# Altium project multimeter.prjpcb
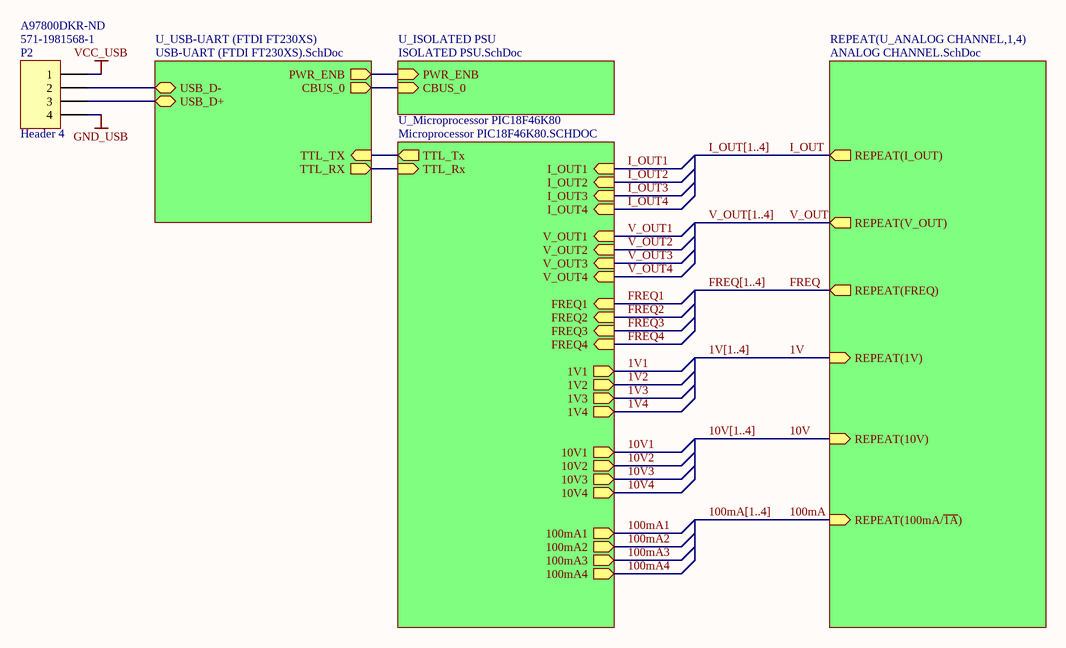
[diagram p0: Multi2Meter.SchDoc]
5 sheets, 179 parts. Net scope: hierarchical (ports join the sheet entries above them; power ports are global).
Board file: m2m.PcbDoc
Sheets:
  Multi2Meter.SchDoc
    U_ISOLATED PSU = ISOLATED PSU.SchDoc
    U_USB-UART (FTDI FT230XS) = USB-UART (FTDI FT230XS).SchDoc
    U_Microprocessor PIC18F46K80 = Microprocessor PIC18F46K80.SCHDOC
    U_ANALOG CHANNEL1 = ANALOG CHANNEL.SchDoc
    U_ANALOG CHANNEL2 = ANALOG CHANNEL.SchDoc
    U_ANALOG CHANNEL3 = ANALOG CHANNEL.SchDoc
    U_ANALOG CHANNEL4 = ANALOG CHANNEL.SchDoc

## Sheet Multi2Meter.SchDoc
size A4

### Parts
P2  Header 4  Supplier Part Number 1: 571-1981568-1  Supplier Part Number 2: A97800DKR-ND  [MICRO USB]

### Sub-sheets
REPEAT(U_ANALOG CHANNEL,1,4) = ANALOG CHANNEL.SchDoc: REPEAT(FREQ) (out), REPEAT(1V) (in), REPEAT(10V) (in), REPEAT(100mA/~{1A}) (in), REPEAT(I_OUT) (out), REPEAT(V_OUT) (out)
U_ISOLATED PSU = ISOLATED PSU.SchDoc: PWR_ENB (in), CBUS_0 (in)
U_Microprocessor PIC18F46K80 = Microprocessor PIC18F46K80.SCHDOC: TTL_Rx (in), TTL_Tx (out), I_OUT1 (in), I_OUT2 (in), I_OUT3 (in), I_OUT4 (in), V_OUT1 (in), V_OUT2 (in), V_OUT3 (in), V_OUT4 (in), FREQ1 (in), FREQ2 (in), FREQ3 (in), FREQ4 (in), 1V1 (out), 1V2 (out), 1V3 (out), 1V4 (out), 10V1 (out), 10V2 (out), 10V3 (out), 10V4 (out), 100mA1 (out), 100mA2 (out), 100mA3 (out), 100mA4 (out)
U_USB-UART (FTDI FT230XS) = USB-UART (FTDI FT230XS).SchDoc: TTL_TX (in), TTL_RX (out), PWR_ENB (out), CBUS_0 (out), USB_D- (bidir), USB_D+ (bidir)

### Nets
GND_USB: P2.4
VCC_USB: P2.1
1V: sheet REPEAT(U_ANALOG CHANNEL,1,4)/REPEAT(1V)
10V: sheet REPEAT(U_ANALOG CHANNEL,1,4)/REPEAT(10V)
100mA: sheet REPEAT(U_ANALOG CHANNEL,1,4)/REPEAT(100mA/~{1A})
CBUS_0: sheet U_ISOLATED PSU/CBUS_0, sheet U_USB-UART (FTDI FT230XS)/CBUS_0
FREQ: sheet REPEAT(U_ANALOG CHANNEL,1,4)/REPEAT(FREQ)
I_OUT: sheet REPEAT(U_ANALOG CHANNEL,1,4)/REPEAT(I_OUT)
PWR_ENB: sheet U_ISOLATED PSU/PWR_ENB, sheet U_USB-UART (FTDI FT230XS)/PWR_ENB
TTL_RX: sheet U_USB-UART (FTDI FT230XS)/TTL_RX, sheet U_Microprocessor PIC18F46K80/TTL_Rx
TTL_TX: sheet U_USB-UART (FTDI FT230XS)/TTL_TX, sheet U_Microprocessor PIC18F46K80/TTL_Tx
USB_D+: P2.3 ; sheet U_USB-UART (FTDI FT230XS)/USB_D+
USB_D-: P2.2 ; sheet U_USB-UART (FTDI FT230XS)/USB_D-
V_OUT: sheet REPEAT(U_ANALOG CHANNEL,1,4)/REPEAT(V_OUT)

### Buses and harness runs
bus 1V[1..4]
bus 10V[1..4]
bus 100mA[1..4]
bus FREQ[1..4]
bus I_OUT[1..4]
bus V_OUT[1..4]

### Library data of the parts
P2 = Header 4: Header, 4-Pin; LatestRevisionDate: 17-Jul-2002; LatestRevisionNote: Re-released for DXP Platform.; Publisher: Altium Limited; Supplier 1: Mouser; Supplier 2: Digi-Key

## Sheet ISOLATED PSU.SchDoc
size A4
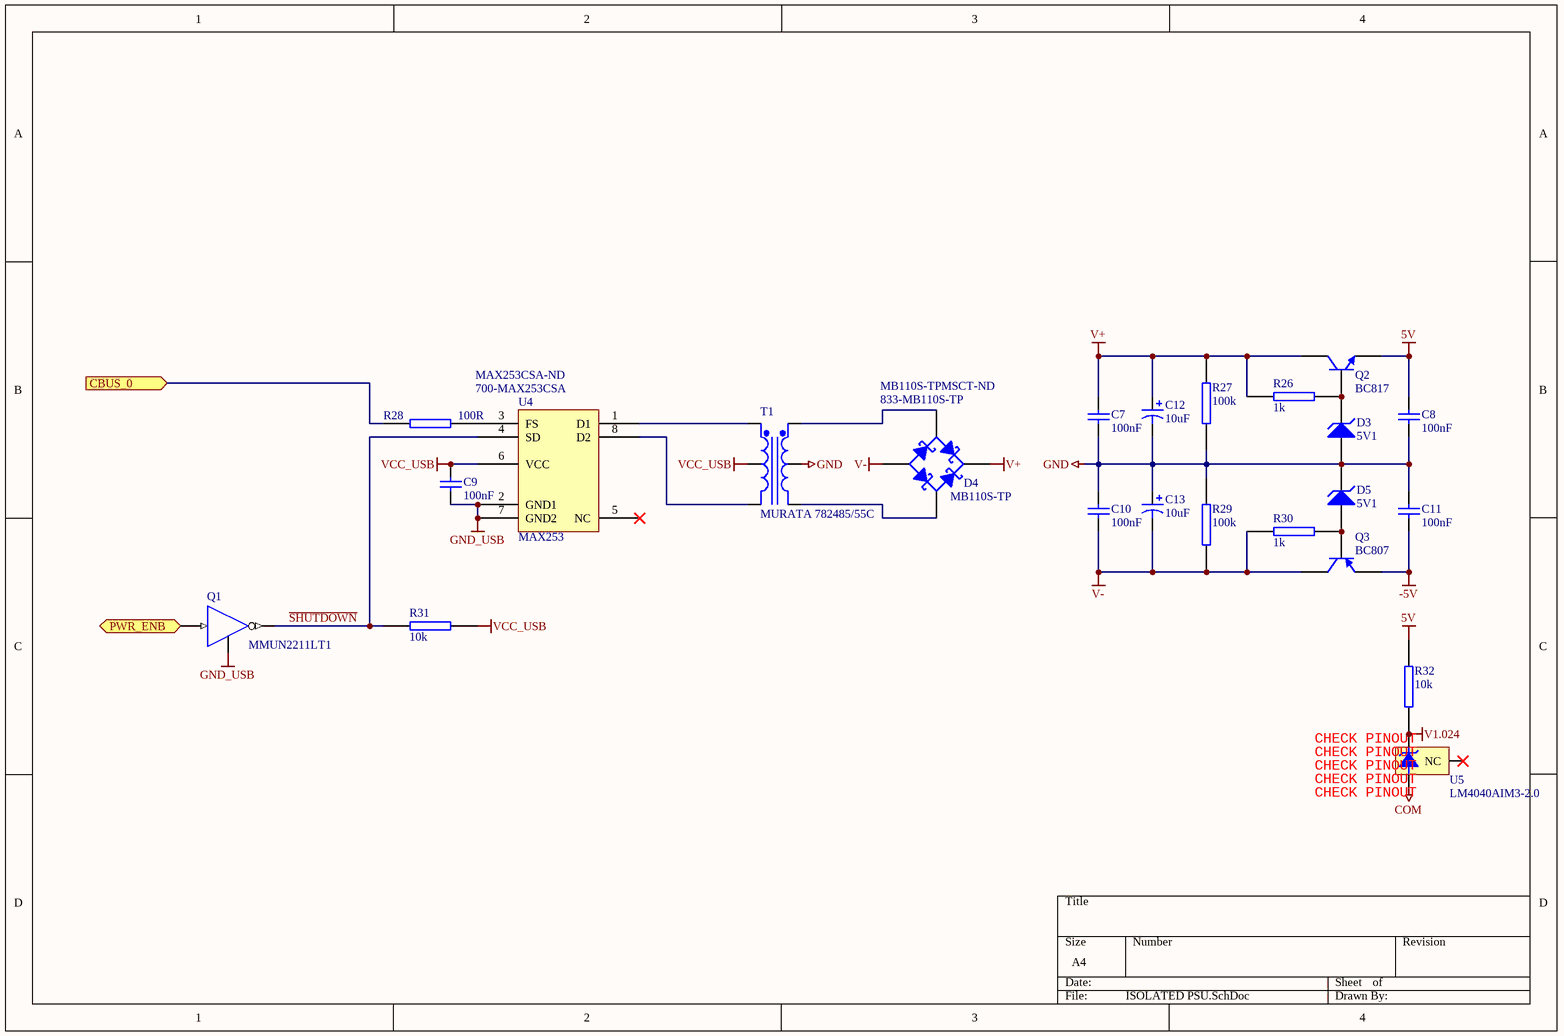
[diagram p1: ISOLATED PSU.SchDoc]

### Parts
C7  100nF  [CAP (3D) - 0603]
C8  100nF  [CAP (3D) - 0603]
C9  100nF  [CAP (3D) - 0603]
C10  100nF  [CAP (3D) - 0603]
C11  100nF  [CAP (3D) - 0603]
C12  10uF  [CAP ELECTRO SIZE-B]
C13  10uF  [CAP ELECTRO SIZE-B]
D3  5V1  [SOT23-3L]
D4  MB110S-TP  Supplier Part Number 1: 833-MB110S-TP  Supplier Part Number 2: MB110S-TPMSCT-ND  [TO-269AA]
D5  5V1  [SOT23-3L]
Q1  MMUN2211LT1  [SOT23-3L]
Q2  BC817  [SOT23-3L]
Q3  BC807  [SOT23-3L]
R26  1k  [RES (3D) - 0603]
R27  100k  [RES (3D) - 0603]
R28  100R  [RES (3D) - 0603]
R29  100k  [RES (3D) - 0603]
R30  1k  [RES (3D) - 0603]
R31  10k  [RES (3D) - 0603]
R32  10k  [RES (3D) - 0603]
T1  MURATA 782485/55C  [78248]
U4  MAX253  Supplier Part Number 1: 700-MAX253CSA  Supplier Part Number 2: MAX253CSA-ND  [SO-8C_L]
U5  LM4040AIM3-2.0  [SOT23-3L]

### Ports
CBUS_0 (in), PWR_ENB (in)

### Nets
5V: C8.2 Q2.3(E) R32.2
-5V: C11.1 Q3.1(E)
COM: U5.2(-V)
GND: C7.1 C8.1 C10.2 C11.2 C12.2 C13.1 D3.1(A) D5.2(K) R27.2 R29.1 T1.5(SecCT)
GND_USB: C9.1 Q1.2(E) U4.2(GND1) U4.7(GND2)
V1.024: R32.1 U5.1(+V)
V+: C7.2 C12.1 D4.1(K) Q2.1(C) R26.2 R27.1
V-: C10.1 C13.2 D4.3(A) Q3.3(C) R29.2 R30.2
VCC_USB: C9.2 R31.1 T1.2(PriCT) U4.6(VCC)
CBUS_0: R28.1 ; port CBUS_0
PWR_ENB: Q1.1(B) ; port PWR_ENB
~{SHUTDOWN}: Q1.3(C) R31.2 U4.4(SD)
NetD3_2: D3.2(K) Q2.2(B) R26.1
NetD4_2: D4.2(C) T1.4(Sec-)
NetD4_4: D4.4(C) T1.6(Sec+)
NetD5_1: D5.1(A) Q3.2(B) R30.1
NetR28_2: R28.2 U4.3(FS)
NetT1_1: T1.1(Pri+) U4.1(D1)
NetT1_3: T1.3(Pri-) U4.8(D2)

Not connected (* = marked no-connect by the designer): U4 5(NC)*; U5 3(NC)*

### Notes on the sheet
- (near U5) CHECK PINOUT

### Library data of the parts
C7-C11 = Cap: Capacitor; Value: 100nF; Supplier 1: Mouser; Supplier 2: Digi-Key; Supplier Part Number 1: 603-C0603ZRY5V9BB104; Supplier Part Number 2: 311-1343-2-ND
C12 C13 = Cap Pol1: Polarized Capacitor (Radial); Value: 10uF
D3 D5 = D Zener: Zener Diode; pin to pad: 2>3; Value: 5V1; Supplier 1: Mouser; Supplier Part Number 1: 625-BZX84C5V1-V; Supplier 2: Digi-Key; Supplier Part Number 2: BZX84C5V1-V-GS08CT-ND
D4 = Bridge1: Full Wave Schottky Diode Bridge; Published: 8-Jun-2000; LatestRevisionDate: 29-May-2009; LatestRevisionNote: Sch pins A & K swapped.; DatasheetVersion: E2732B; PackageReference: D-38; Publisher: Altium Limited; PackageDescription: Bridge Rectifier; 4 Terminals; Body 9.4 x 9.4 mm (typ); Pitch 5.08 mm; Value: MB110S-TP; Supplier 1: Mouser; Supplier 2: Digi-Key
Q1 = NPN DIGITAL TRANSISTOR: Manufacturer: ON SEMO; Manufacturer Part No.: MMUN2211LT1G; Mouser Part no.: 863-MMUN2211LT1G; Web link: http://au.mouser.com/ProductDetail/ON-Semiconductor/MMUN2211LT1G/?qs=ZpPixqFcBtyOBGnml%2fmJx1k1aPkM%252ba71PMQX%2fEUGWkQ%3d; value: MMUN2211; Supplier 1: Mouser; Supplier Part Number 1: 863-MMUN2211LT1G; Supplier 2: Digi-Key; Supplier Part Number 2: MMUN2211LT1GOSCT-ND
Q2 = BC817: NPN Bipolar Transistor; pin to pad: 1>3 2>1 3>2; Manufacturer: ON Semiconductor; Manufacturer Part No.: BC817-25LT1G; Revision: July-2002: Re-released for DXP Platform.; Mouser Part no.: 863-BC817-25LT1G; Farnell Part no.: 1081223; value: BC817; Web link: http://au.mouser.com/ProductDetail/ON-Semiconductor/BC817-25LT1G/?qs=sGAEpiMZZMutXGli8Ay4kJTaSFKHrKTHz5OxB%252bfaCCM%3d
Q3 = 2N3906: PNP General Purpose Amplifier; Value: BC807
R26-R31 = RES SMD 0603 100R: RESISTOR SMD 0603
  R26 R30: Value: 1k
  R27 R29: Value: 100k
  R28: Value: 100R
  R31: Value: 10k
R32 = RES SMD 0603 10k: RESISTOR SMD 0603 10k; Manufacturer: Bourns; Manufacturer Part No.: CR0603FX-1002ELF; Mouser Part no.: 652-CR0603FX-1002ELF; Web link: http://au.mouser.com/Search/Refine.aspx?Keyword=652-CR0603FX-1002ELF; value: 10k
T1 = Trans CT: Center-Tapped Transformer (Coupled Inductor Model); Published: 8-Jun-2000; LatestRevisionDate: 17-Jul-2002; LatestRevisionNote: Re-released for DXP Platform.; PackageReference: TRF_5; Publisher: Altium Limited; PackageDescription: Transformer; 5 Leads; Value: MURATA 782485/55C
U5 = LM4040AIM3-2.0: Precision Micropower Shunt Voltage Reference; Manufacturer: National Semiconductor; CompType: Voltage Reference IC; PackageTopMarking: RJA*XTT; PowerWise: N; Published: 4-Dec-2008; DatasheetVersion: Apr-2005; PackageVersion: revB, Mar-2003; PackageReference: MF03A; Publisher: Altium Limited; PackageDescription: Molded SOT-23, .115 x .051 x .037in Body, 3 Lead, .075 in Pitch; PartNumber: LM4040AIM3-2.0; RoHS: O; PinCount: 3; DigiKeyPartNumber: LM4040AIM3-2.0-ND; ComponentLink1Description: LM4040 Datasheet; ComponentLink1URL: http://www.national.com/ds/LM/LM4040.pdf; ComponentLink2Description: LM4040 Web Page; ComponentLink2URL: http://www.national.com/pf/LM/LM4040.html; ComponentLink3Description: MF03A Package Page; ComponentLink3URL: http://www.national.com/packaging/folders/mf03a.html
U4 = MAX253: Value: MAX253; Supplier 1: Mouser; Supplier 2: Digi-Key

## Sheet USB-UART (FTDI FT230XS).SchDoc
size A4; Revision: 0; SheetNumber: 1
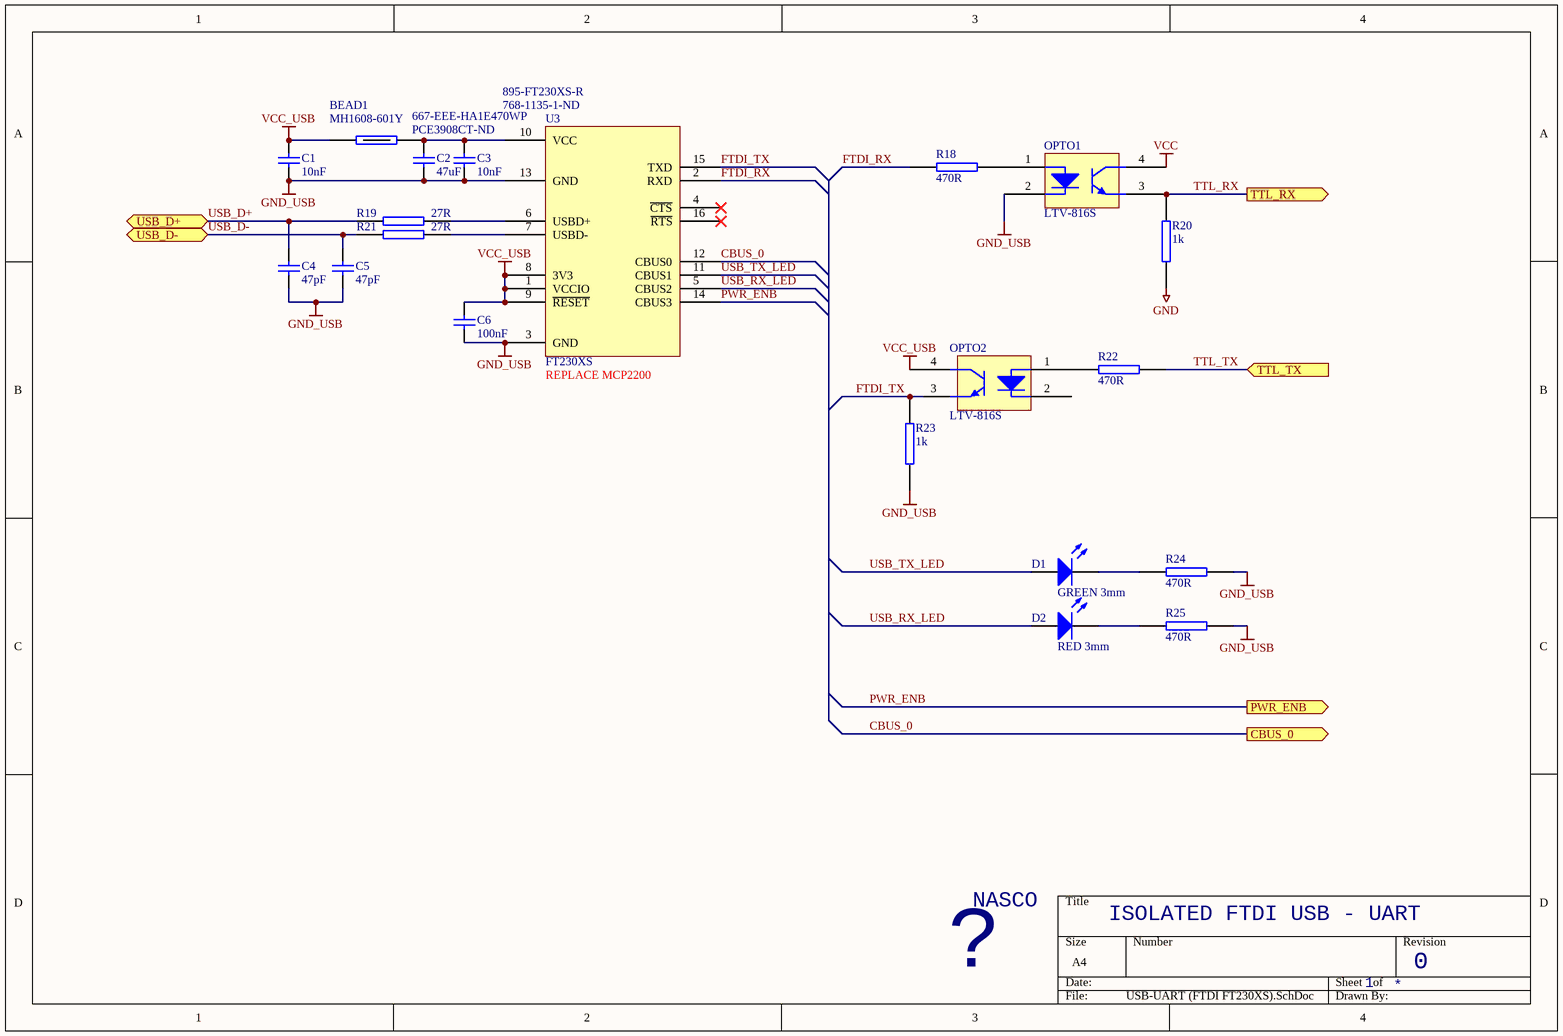
[diagram p2: USB-UART (FTDI FT230XS).SchDoc]

### Parts
BEAD1  MH1608-601Y  [RES (3D) - 0603]
C1  10nF  [CAP (3D) - 0603]
C2  Supplier Part Number 1: PCE3908CT-ND  Supplier Part Number 2: 667-EEE-HA1E470WP  [CAP ELECTRO SIZE-D]  (hidden comment: 47uF)
C3  10nF  [CAP (3D) - 0603]
C4  47pF  [CAP (3D) - 0603]
C5  47pF  [CAP (3D) - 0603]
C6  100nF  [CAP (3D) - 0603]
D1  GREEN 3mm  [LED(3D) 3MM VERTICAL (GREEN)]
D2  RED 3mm  [LED(3D) 3MM VERTICAL (GREEN)]
OPTO1  LTV-816S  [S-DIP-B8]
OPTO2  LTV-816S  [S-DIP-B8]
R18  470R  [RES (3D) - 0603]
R19  27R  [RES (3D) - 0603]
R20  1k  [RES (3D) - 0603]
R21  27R  [RES (3D) - 0603]
R22  470R  [RES (3D) - 0603]
R23  1k  [RES (3D) - 0603]
R24  470R  [RES (3D) - 0603]
R25  470R  [RES (3D) - 0603]
U3  FT230XS  Supplier Part Number 1: 768-1135-1-ND  Supplier Part Number 2: 895-FT230XS-R  [SSOP16_L]

### Ports
CBUS_0 (out), PWR_ENB (out), TTL_RX (out), TTL_TX (in), USB_D+ (bidir), USB_D- (bidir)

### Nets
GND: R20.1
GND_USB: C1.1 C2.1 C3.1 C4.1 C5.1 C6.1 OPTO1.2 R23.1 R24.2 R25.2 U3.3(GND) U3.13(GND)
VCC: OPTO1.4
VCC_USB: BEAD1.1 C1.2 C6.2 OPTO2.4 U3.1(VCCIO) U3.8(3V3) U3.9(~{RESET})
CBUS_0: U3.12(CBUS0) ; port CBUS_0
FTDI_RX: R18.1 U3.2(RXD)
FTDI_TX: OPTO2.3 R23.2 U3.15(TXD)
PWR_ENB: U3.14(CBUS3) ; port PWR_ENB
TTL_RX: OPTO1.3 R20.2 ; port TTL_RX
TTL_TX: R22.2 ; port TTL_TX
USB_D+: C4.2 R19.1 ; port USB_D+
USB_D-: C5.2 R21.1 ; port USB_D-
USB_RX_LED: D2.1(A) U3.5(CBUS2)
USB_TX_LED: D1.1(A) U3.11(CBUS1)
NetBEAD1_2: BEAD1.2 C2.2 C3.2 U3.10(VCC)
NetD1_2: D1.2(K) R24.1
NetD2_2: D2.2(K) R25.1
NetOPTO1_1: OPTO1.1 R18.2
NetOPTO2_1: OPTO2.1 R22.1
NetR19_2: R19.2 U3.6(USBD+)
NetR21_2: R21.2 U3.7(USBD-)

Not connected (* = marked no-connect by the designer): OPTO2 2; U3 4(~{CTS})* 16(~{RTS})*

### Notes on the sheet
- (near U3) REPLACE MCP2200
- NASCO
- ISOLATED FTDI USB - UART
- ?

### Library data of the parts
BEAD1 = FERRITE BEAD 0603: FERRITE BEAD 0603 BOURNS MH1608-601Y; Value: MH1608-601Y
C1-C6 = Cap: Capacitor
  C1 C3: Value: 10nF
  C2: Value: 47uF; Supplier 1: Digi-Key; Supplier 2: Mouser
  C4 C5: Value: 47pF
  C6: Value: 100nF; Supplier 1: Mouser; Supplier 2: Digi-Key; Supplier Part Number 1: 603-C0603ZRY5V9BB104; Supplier Part Number 2: 311-1343-2-ND
D1 D2 = LED 3mm RED: 3mm RED LED; Manufacturer: Kingbright; Manufacturer Part No.: WP132XIT; Mouser Part no.: 604-WP132XIT; Farnell Part no.: 1003393; Web link: http://au.mouser.com/Search/Refine.aspx?Keyword=604-WP132XIT
  D1: Value: GREEN 3mm
  D2: Value: RED 3mm
OPTO1 OPTO2 = LTV-816S: Transistor Output Optocoupler; Supplier 1: Mouser; Supplier 2: Digi-Key; Supplier Part Number 1: 859-LTV-816S; Supplier Part Number 2: 160-1361-5-ND
R18 R20 R22-R25 = RES SMD 0603 1k: RESISTOR SMD 0603 1k
  R18 R22 R24 R25: value: 470R
  R20 R23: value: 1k
R19 R21 = RES SMD 0603 100R: RESISTOR SMD 0603; Value: 27R
U3 = FTDI FT230XS: FTDI FT230XS USB - UART; Supplier 1: Digi-Key; Supplier 2: Mouser

## Sheet Microprocessor PIC18F46K80.SCHDOC
size A4; PageSetup: Record=PageOptions|CenterHorizontal=True|CenterVertical=True|PrintScale=0.70|XCorrection=1.00|YCorrection=1.00|PrintKind=2|BorderSize=5000000|LeftOffset=0|BottomOffset=0|Orientation=2|PaperLength=1000|PaperWidth=1000|Scale=100|PaperSource=7|PrintQuality=-4|MediaType=1|DitherType=10|PaperKind=A4|PrintScaleMode=1; DocumentName: CCPA V203 (RELEASE)
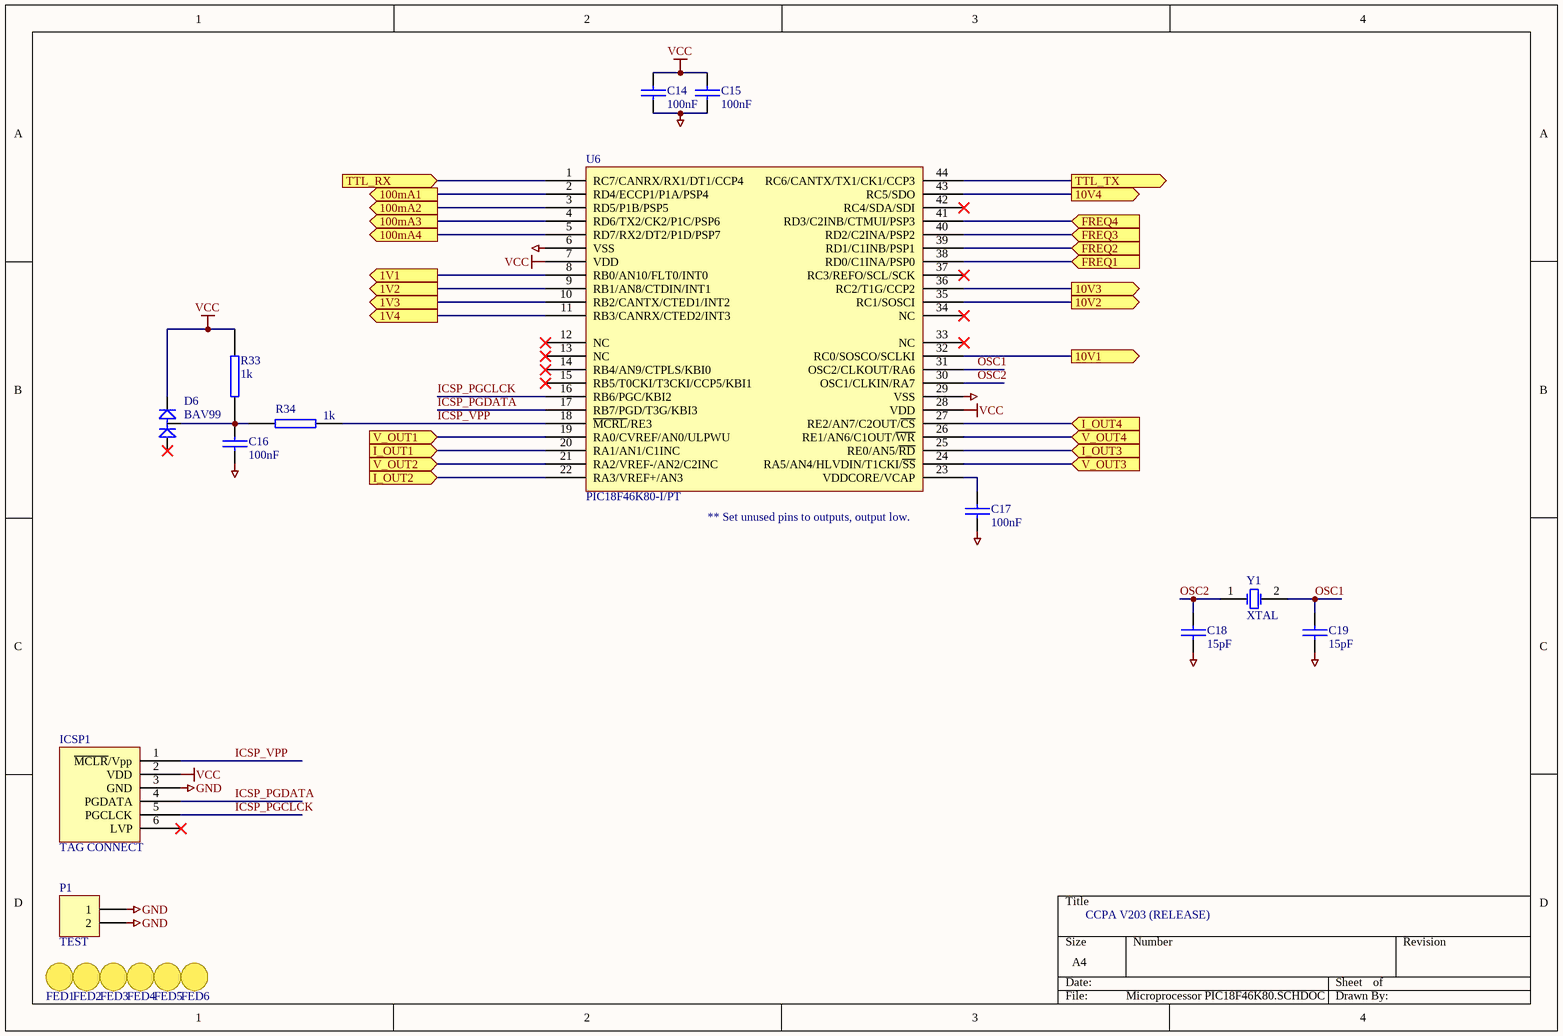
[diagram p3: Microprocessor PIC18F46K80.SCHDOC]

### Parts
C14  100nF  [CAP (3D) - 0603]
C15  100nF  [CAP (3D) - 0603]
C16  100nF  [CAP (3D) - 0603]
C17  100nF  [CAP (3D) - 0603]
C18  15pF  [CAP (3D) - 0603]
C19  15pF  [CAP (3D) - 0603]
D6  BAV99  [SOT23-3L]
FED1  Feducial  [Feducial]  (value not drawn)
FED2  Feducial  [Feducial]  (value not drawn)
FED3  Feducial  [Feducial]  (value not drawn)
FED4  Feducial  [Feducial]  (value not drawn)
FED5  Feducial  [Feducial]  (value not drawn)
FED6  Feducial  [Feducial]  (value not drawn)
ICSP1  TAG CONNECT  [ICSP - TAG CONNECT TYPE2]
P1  TEST  [HDR1X2]
R33  1k  [RES (3D) - 0603]
R34  1k  [RES (3D) - 0603]
U6  PIC18F46K80-I/PT  [TQFP44_L]
Y1  XTAL  [HC49/4H_SMX]

### Ports
1V1 (out), 1V2 (out), 1V3 (out), 1V4 (out), 10V1 (out), 10V2 (out), 10V3 (out), 10V4 (out), 100mA1 (out), 100mA2 (out), 100mA3 (out), 100mA4 (out), FREQ1 (in), FREQ2 (in), FREQ3 (in), FREQ4 (in), I_OUT1 (in), I_OUT2 (in), I_OUT3 (in), I_OUT4 (in), TTL_RX (in), TTL_TX (out), V_OUT1 (in), V_OUT2 (in), V_OUT3 (in), V_OUT4 (in)

### Nets
GND: C14.2 C15.2 C16.2 C17.2 C18.2 C19.2 ICSP1.3(GND) P1.1 P1.2 U6.6(VSS) U6.29(VSS)
VCC: C14.1 C15.1 D6.2(C2) ICSP1.2(VDD) R33.1 U6.7(VDD) U6.28(VDD)
1V: U6.8(RB0/AN10/FLT0/INT0) ; port 1V1
1V: U6.9(RB1/AN8/CTDIN/INT1) ; port 1V2  [a separate net that carries the same name]
1V: U6.10(RB2/CANTX/CTED1/INT2) ; port 1V3  [a separate net that carries the same name]
1V: U6.11(RB3/CANRX/CTED2/INT3) ; port 1V4  [a separate net that carries the same name]
10V: U6.32(RC0/SOSCO/SCLKI) ; port 10V1
10V: U6.35(RC1/SOSCI) ; port 10V2  [a separate net that carries the same name]
10V: U6.36(RC2/T1G/CCP2) ; port 10V3  [a separate net that carries the same name]
10V: U6.43(RC5/SDO) ; port 10V4  [a separate net that carries the same name]
100mA1: U6.2(RD4/ECCP1/P1A/PSP4) ; port 100mA1
100mA2: U6.3(RD5/P1B/PSP5) ; port 100mA2
100mA3: U6.4(RD6/TX2/CK2/P1C/PSP6) ; port 100mA3
100mA4: U6.5(RD7/RX2/DT2/P1D/PSP7) ; port 100mA4
FREQ1: U6.38(RD0/C1INA/PSP0) ; port FREQ1
FREQ2: U6.39(RD1/C1INB/PSP1) ; port FREQ2
FREQ3: U6.40(RD2/C2INA/PSP2) ; port FREQ3
FREQ4: U6.41(RD3/C2INB/CTMUI/PSP3) ; port FREQ4
I_OUT1: U6.20(RA1/AN1/C1INC) ; port I_OUT1
I_OUT2: U6.22(RA3/VREF+/AN3) ; port I_OUT2
I_OUT3: U6.25(RE0/AN5/~{RD}) ; port I_OUT3
I_OUT4: U6.27(RE2/AN7/C2OUT/~{CS}) ; port I_OUT4
ICSP_PGCLCK: ICSP1.5(PGCLCK) U6.16(RB6/PGC/KBI2)
ICSP_PGDATA: ICSP1.4(PGDATA) U6.17(RB7/PGD/T3G/KBI3)
ICSP_VPP: ICSP1.1(~{MCLR}/Vpp) R34.2 U6.18(~{MCRL}/RE3)
OSC1: C19.1 U6.31(OSC2/CLKOUT/RA6) Y1.2(OSC2)
OSC2: C18.1 U6.30(OSC1/CLKIN/RA7) Y1.1(OSC1)
TTL_RX: U6.1(RC7/CANRX/RX1/DT1/CCP4) ; port TTL_RX
TTL_TX: U6.44(RC6/CANTX/TX1/CK1/CCP3) ; port TTL_TX
V_OUT1: U6.19(RA0/CVREF/AN0/ULPWU) ; port V_OUT1
V_OUT2: U6.21(RA2/VREF-/AN2/C2INC) ; port V_OUT2
V_OUT3: U6.24(RA5/AN4/HLVDIN/T1CKI/~{SS}) ; port V_OUT3
V_OUT4: U6.26(RE1/AN6/C1OUT/~{WR}) ; port V_OUT4
NetC16_1: C16.1 D6.3(C1/A2) R33.2 R34.1
NetC17_1: C17.1 U6.23(VDDCORE/VCAP)

Not connected (* = marked no-connect by the designer): D6 1(A1)*; ICSP1 6(LVP)*; U6 12(NC)* 13(NC)* 14(RB4/AN9/CTPLS/KBI0)* 15(RB5/T0CKI/T3CKI/CCP5/KBI1)* 33(NC)* 34(NC)* 37(RC3/REFO/SCL/SCK)* 42(RC4/SDA/SDI)*

### Notes on the sheet
- (near C17) ** Set unused pins to outputs, output low.

### Library data of the parts
C14-C17 = CAP: CAPACITOR SMD 0402; Manufacturer: Murata; Manufacturer Part No.: GRM155R61C104KA88D; value: 100nF; Mouser Part no.: 81-GRM155R61C104KA8D; Web link: http://au.mouser.com/ProductDetail/Murata/GRM155R61C104KA88D/?qs=sGAEpiMZZMvQvaS66kI3TkNFPW5pBWErgqKrdkfeYZ0%3d; Farnell Part no.: 1414610
C18 C19 = CAP: CAPACITOR SMD 0402; Manufacturer: Xicon; Manufacturer Part No.: 140-CC504N150J-RC; value: 15pF; Mouser Part no.: 140-CC504N150J-RC; Web link: http://au.mouser.com/ProductDetail/Xicon/140-CC504N150J-RC/?qs=0ZUpllj3bsY%252bl3b%252btrhy8ZRrWnFRAos3
D6 = BAV99: DUAL DIODE, BAV99; Manufacturer: FAIRCHILD SEMICONDUCTOR; Mouser Part no.: 771-BAV99/T3; Manufacturer Part No.: BAV99; value: BAV99; Web link: http://au.mouser.com/ProductDetail/NXP/BAV99-T3/?qs=84A%2fDAdkstK527JD1pwcnQ%3d%3d
FED1-FED6 = Feducial: Manufacturer: N/A - PCB ARTWORK; Manufacturer Part No.: N/A
ICSP1 = ICSP - TAG CONNECT: Manufacturer: N/A - PCB ARTWORK; Manufacturer Part No.: N/A; Mouser Part no.: N/A; Web link: N/A - PCB ARTWORK
P1 = Header 2: Header, 2-Pin; Manufacturer: Bourns; Manufacturer Part No.: CR0603-FX-5900ELF; value: 590R; Mouser Part no.: 652-CR0603FX-5900ELF; Web link: http://au.mouser.com/Search/Refine.aspx?Keyword=652-CR0603FX-5900ELF
R33 = RES SMD 0603 10k: RESISTOR SMD 0603 10k; Manufacturer: Bourns; Manufacturer Part No.: CR0603-JW-102ELF; Mouser Part no.: 652-CR0603-JW-102ELF; Web link: http://au.mouser.com/ProductDetail/Bourns/CR0603-JW-102ELF/?qs=sGAEpiMZZMu61qfTUdNhG2nPoCjtvs%252bRXTOJv8O9Kbk%3d; value: 1k; Farnell Part no.: 9331700
R34 = RES SMD 0603 100R: RESISTOR SMD 0603; Manufacturer: Bourns; Manufacturer Part No.: CR0603-JW-102ELF; Mouser Part no.: 652-CR0603-JW-102ELF; Farnell Part no.: 9331700; Web link: http://au.mouser.com/ProductDetail/Bourns/CR0603-JW-102ELF/?qs=sGAEpiMZZMu61qfTUdNhG2nPoCjtvs%252bRXTOJv8O9Kbk%3d; Value: 1k
U6 = PIC18F4XK80-I/PT: Manufacturer: MICROCHIP; Manufacturer Part No.: PIC18F46K80-I/PT; Mouser Part no.: 579-PIC18F46K80-I/PT; value: PIC18F46K80-I/PT; Web link: http://au.mouser.com/ProductDetail/Microchip/PIC18F46K80-I-PT/?qs=LU7oW20kJpOTrBvFk2hM5g%3d%3d
Y1 = XTAL: Crystal Oscillator; Manufacturer: ECS; Manufacturer Part No.: ECS-160-20-5PX-TR; value: 16MHz; Mouser Part no.: 520-CSM1600-20-X; Web link: http://au.mouser.com/ProductDetail/ECS/ECS-160-20-5PX-TR/?qs=CkbNAJEAr%2fRSmE52Hssuc4XnCMYWVt7B

## Sheet ANALOG CHANNEL.SchDoc
size A4; DrawnBy: SML; Revision: 0; SheetNumber: 2; Title2: Title2
Used 4 times, as channels U_ANALOG CHANNEL1, U_ANALOG CHANNEL2, U_ANALOG CHANNEL3, U_ANALOG CHANNEL4. Parts and nets are listed once, with the designators drawn on the sheet.
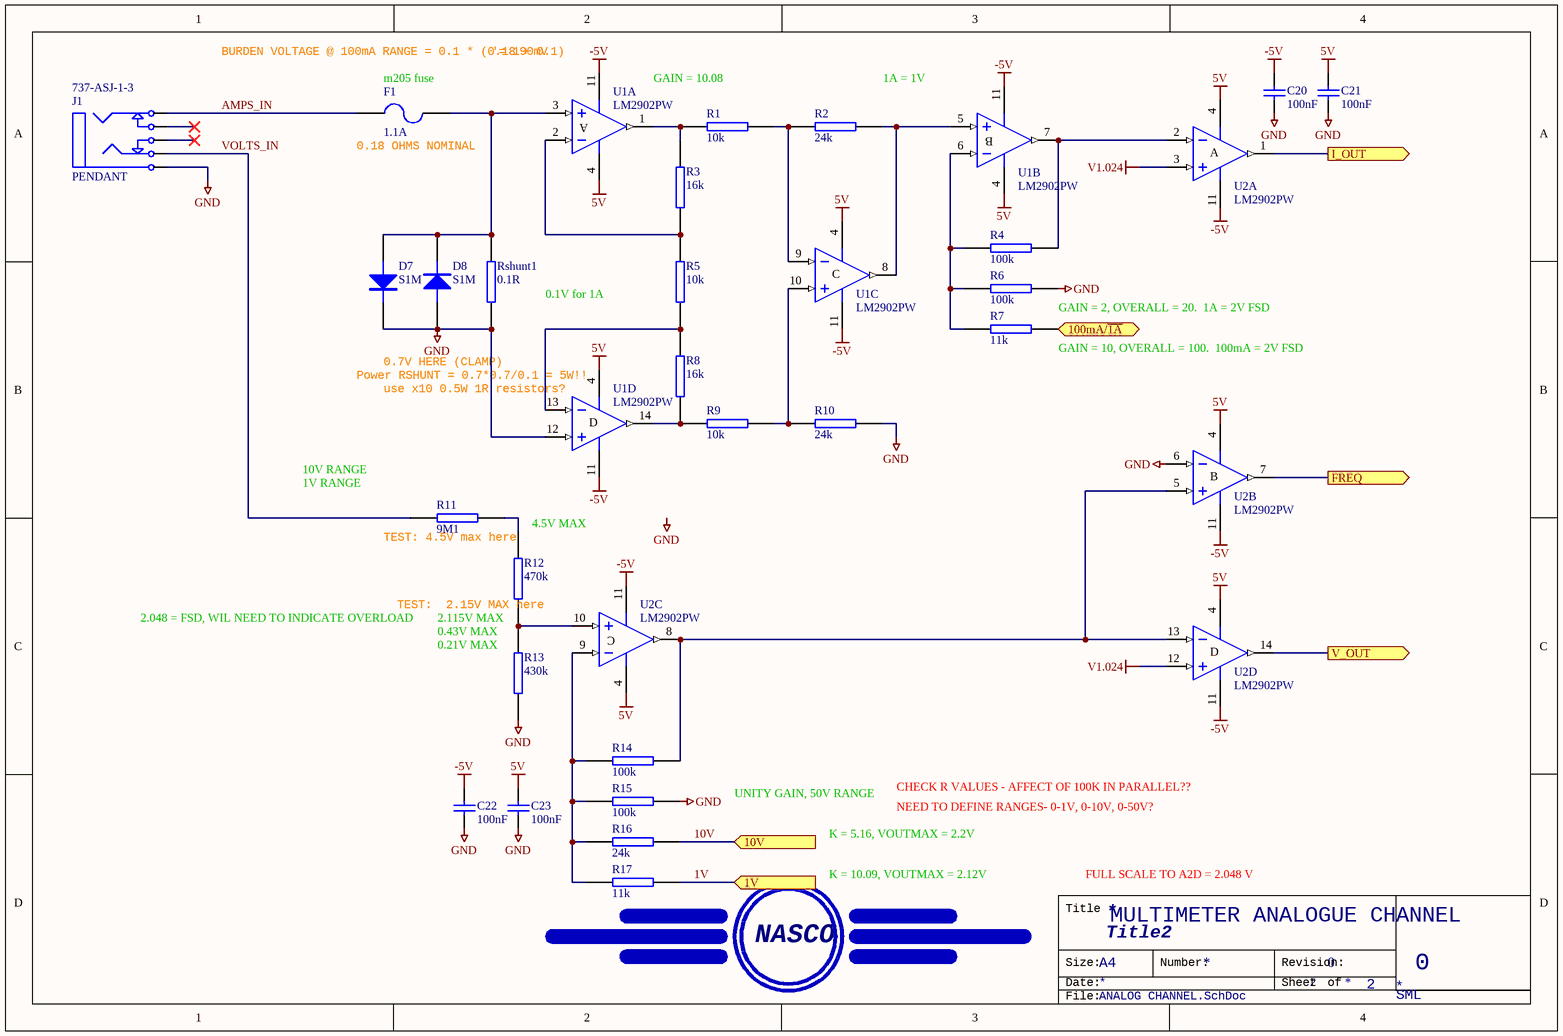
[diagram p4: ANALOG CHANNEL.SchDoc]

### Parts
?  (no value)  (no BOM)
C20  100nF  [CAP (3D) - 0603]
C21  100nF  [CAP (3D) - 0603]
C22  100nF  [CAP (3D) - 0603]
C23  100nF  [CAP (3D) - 0603]
D7  S1M  [DO-214AC]
D8  S1M  [DO-214AC]
F1  1.1A  [LITTELFUSE 1210]
J1  PENDANT  Supplier Part Number 1: 737-ASJ-1-3  [3.5MM pcb mouNt]
R1  10k  [RES (3D) - 0603]
R2  24k  [RES (3D) - 0603]
R3  16k  [RES (3D) - 0603]
R4  100k  [RES (3D) - 0603]
R5  10k  [RES (3D) - 0603]
R6  100k  [RES (3D) - 0603]
R7  11k  [RES (3D) - 0603]
R8  16k  [RES (3D) - 0603]
R9  10k  [RES (3D) - 0603]
R10  24k  [RES (3D) - 0603]
R11  9M1  [RES (3D) - 0603]
R12  470k  [RES (3D) - 0603]
R13  430k  [RES (3D) - 0603]
R14  100k  [RES (3D) - 0603]
R15  100k  [RES (3D) - 0603]
R16  24k  [RES (3D) - 0603]
R17  11k  [RES (3D) - 0603]
Rshunt1  0.1R  [1T-2512]
U1  LM2902PW  [PW014_N]  (parts A,B,C,D of 4)
U2  LM2902PW  [PW014_N]  (parts A,B,C,D of 4)

### Ports
1V (in), 10V (in), 100mA/~{1A} (in), FREQ (out), I_OUT (out), V_OUT (out)

### Nets
5V: C21.2 C23.2 U1.4(V+) U2.4(V+)
-5V: C20.2 C22.2 U1.11(V-) U2.11(V-)
GND: C20.1 C21.1 C22.1 C23.1 D7.2(K) D8.1(A) J1.1 R6.1 R10.1 R13.2 R15.1 Rshunt1.1 U1.12(IN+) U2.6(IN-)
V1.024: U2.3(IN+) U2.12(IN+)
1V: R17.1 ; port 1V
10V: R16.1 ; port 10V
100mA/~{1A}: R7.1 ; port 100mA/~{1A}
AMPS_IN: F1.1 J1.5
FREQ: U2.7(OUT) ; port FREQ
I_OUT: U2.1(OUT) ; port I_OUT
V_OUT: U2.14(OUT) ; port V_OUT
VOLTS_IN: J1.2 R11.1
NetD7_1: D7.1(A) D8.2(K) F1.2 Rshunt1.2 U1.3(IN+)
NetR1_1: R1.1 R2.2 U1.9(IN-)
NetR1_2: R1.2 R3.1 U1.1(OUT)
NetR2_1: R2.1 U1.5(IN+) U1.8(OUT)
NetR3_2: R3.2 R5.2 U1.2(IN-)
NetR4_1: R4.1 U1.7(OUT) U2.2(IN-)
NetR4_2: R4.2 R6.2 R7.2 U1.6(IN-)
NetR5_1: R5.1 R8.1 U1.13(IN-)
NetR8_2: R8.2 R9.2 U1.14(OUT)
NetR9_1: R9.1 R10.2 U1.10(IN+)
NetR11_2: R11.2 R12.1
NetR12_2: R12.2 R13.1 U2.10(IN+)
NetR14_1: R14.1 U2.5(IN+) U2.8(OUT) U2.13(IN-)
NetR14_2: R14.2 R15.2 R16.2 R17.2 U2.9(IN-)

Not connected (* = marked no-connect by the designer): J1 3* 4*

### Channels
U_ANALOG CHANNEL1: designators end in A; ports 1V=1V 10V=10V 100mA/~{1A}=100mA1 FREQ=FREQ1 I_OUT=I_OUT1 V_OUT=V_OUT1
U_ANALOG CHANNEL2: designators end in B; ports 1V=1V 10V=10V 100mA/~{1A}=100mA2 FREQ=FREQ2 I_OUT=I_OUT2 V_OUT=V_OUT2
U_ANALOG CHANNEL3: designators end in C; ports 1V=1V 10V=10V 100mA/~{1A}=100mA3 FREQ=FREQ3 I_OUT=I_OUT3 V_OUT=V_OUT3
U_ANALOG CHANNEL4: designators end in D; ports 1V=1V 10V=10V 100mA/~{1A}=100mA4 FREQ=FREQ4 I_OUT=I_OUT4 V_OUT=V_OUT4

### Notes on the sheet
- BURDEN VOLTAGE @ 100mA RANGE = 0.1 * (0.18 + 0.1)
- (near F1) m205 fuse
- (near U1) '= 190mV
- GAIN = 10.08
- 1A = 1V
- (near F1) 0.18 OHMS NOMINAL
- 0.1V for 1A
- GAIN = 2, OVERALL = 20.  1A = 2V FSD
- (near U1) Power RSHUNT = 0.7*0.7/0.1 = 5W!!
- 0.7V HERE (CLAMP)
- (near R7) GAIN = 10, OVERALL = 100.  100mA = 2V FSD
- (near U1) use x10 0.5W 1R resistors?
- 10V RANGE
- 1V RANGE
- TEST: 4.5V max here
- (near R12) 4.5V MAX
- 2.048 = FSD, WIL NEED TO INDICATE OVERLOAD
- (near R12) TEST:  2.15V MAX here
- 2.115V MAX
- 0.43V MAX
- (near R13) 0.21V MAX
- CHECK R VALUES - AFFECT OF 100K IN PARALLEL??
- UNITY GAIN, 50V RANGE
- K = 5.16, VOUTMAX = 2.2V
- NEED TO DEFINE RANGES- 0-1V, 0-10V, 0-50V?
- K = 10.09, VOUTMAX = 2.12V
- FULL SCALE TO A2D = 2.048 V
- MULTIMETER ANALOGUE CHANNEL
- Labels drawn without touching a wire or pin: GND
- Title
- NASCO
- Size:
- Date:
- A4
- Number:
- Revision:
- Sheet
- of
- File:
- (in symbol LM2902PW, part A) A
- (in symbol LM2902PW, part B) B
- (in symbol LM2902PW, part C) C
- (in symbol LM2902PW, part D) D

### Library data of the parts
? = NASCO_LOGO: LOGO
C20-C23 = Cap: Capacitor; Value: 100nF; Supplier 1: Mouser; Supplier 2: Digi-Key; Supplier Part Number 1: 603-C0603ZRY5V9BB104; Supplier Part Number 2: 311-1343-2-ND
D7 D8 = DIODE: DIODE, POWER; Manufacturer: TAIWAN SEMI; Mouser Part no.: 821-S1M; Manufacturer Part No.: S1M; value: S1M; Web link: http://au.mouser.com/ProductDetail/Taiwan-Semiconductor/S1M/?qs=sGAEpiMZZMtEwUVCuofpuOlSmRjzJonf%252bmrIm0%252bGbjE%3d
F1 = Fuse 2: Fuse; Manufacturer: Littlefuse; Manufacturer Part No.: 1206L110THYR; Revision: July-2002: Re-released for DXP Platform.; Mouser Part No.: 576-1206L110THYR; Value: 1.1A; Web link: http://au.mouser.com/ProductDetail/Littelfuse/1206L110THYR/?qs=sGAEpiMZZMu7EFbsM1w0ne5Dyqsx7igC3NaPmo8Qtk8%3d
J1 = Phonejack Stereo SW: 3-Conductor Jack with 2 break contacts (normals) and 2 auxiliary make contacts; Altronics Part no.: P0073; Manufacturer: Neutrik; Manufacturer Part No.: NMJ6HFD2; Mouser Part no.: 550-20301; Web link: http://au.mouser.com/ProductDetail/Neutrik/NMJ6HFD2/?qs=y5MlCMoPWsng3r9W7xlRqw%3d%3d; Supplier 1: Mouser
R1-R10 R14-R17 = RES SMD 0603 10k: as R32 on sheet ISOLATED PSU; Mouser Part no.: 652-CR0603FX-1002ELF; Web link: http://au.mouser.com/Search/Refine.aspx?Keyword=652-CR0603FX-1002ELF
  R1 R5 R9: value: 10k
  R2 R10 R16: value: 24k
  R3 R8: value: 16k
  R4 R6 R14 R15: value: 100k
  R7 R17: value: 11k
R11 = RES SMD 0603 10k: RESISTOR SMD 0603 10k; Manufacturer: Vishay/Dale; Manufacturer Part No.: CRCW06038M06FKEA; Mouser Part no.: 71-CRCW0603-8.06M-E3; Web link: http://au.mouser.com/ProductDetail/Vishay/CRCW06038M06FKEA/?qs=y%252bMD5VLd6nuCUjzPeM%2fNuA%3d%3d; value: 9M1
R12 R13 = RES SMD 0603 10k: RESISTOR SMD 0603 10k; Manufacturer: 71-CRCW0603-1.62M-E3; Manufacturer Part No.: CRCW06031M62FKEA; Mouser Part no.: Vishay/Dale; Web link: http://au.mouser.com/ProductDetail/Vishay-Dale/CRCW06031M62FKEA/?qs=T8SocJY5PJGlLyODpclhGBx5u7VrWxQmuiInBv9Pchc%3d
  R12: value: 470k
  R13: value: 430k
Rshunt1 = RES SMD 0603 10k: RESISTOR SMD 0603; Manufacturer: Bourns; Manufacturer Part No.: CRM2512-FX-R100ELF; Mouser Part no.: 652-CRM2512FXR100ELF; Web link: http://au.mouser.com/ProductDetail/Bourns/CRM2512-FX-R100ELF/?qs=sGAEpiMZZMtlubZbdhIBIArpNfnoOiiHuLMy8C%2fxrAQ%3d; value: 0.1R
U1 U2 = LM2902PW: Quadruple Operational Amplifier

## Nets that join several sheets
5V: ISOLATED PSU (C8.2 Q2.3 R32.2), U_ANALOG CHANNEL1 (C21A.2 C23A.2 U1A.4 U2A.4), U_ANALOG CHANNEL2 (C21B.2 C23B.2 U1B.4 U2B.4), U_ANALOG CHANNEL3 (C21C.2 C23C.2 U1C.4 U2C.4), U_ANALOG CHANNEL4 (C21D.2 C23D.2 U1D.4 U2D.4)
-5V: ISOLATED PSU (C11.1 Q3.1), U_ANALOG CHANNEL1 (C20A.2 C22A.2 U1A.11 U2A.11), U_ANALOG CHANNEL2 (C20B.2 C22B.2 U1B.11 U2B.11), U_ANALOG CHANNEL3 (C20C.2 C22C.2 U1C.11 U2C.11), U_ANALOG CHANNEL4 (C20D.2 C22D.2 U1D.11 U2D.11)
GND: ISOLATED PSU (11 pins), USB-UART (FTDI FT230XS) (R20.1), Microprocessor PIC18F46K80 (11 pins), U_ANALOG CHANNEL1 (14 pins), U_ANALOG CHANNEL2 (14 pins), U_ANALOG CHANNEL3 (14 pins), U_ANALOG CHANNEL4 (14 pins)
GND_USB: Multi2Meter (P2.4), ISOLATED PSU (C9.1 Q1.2 U4.2 U4.7), USB-UART (FTDI FT230XS) (12 pins)
V1.024: ISOLATED PSU (R32.1 U5.1), U_ANALOG CHANNEL1 (U2A.3 U2A.12), U_ANALOG CHANNEL2 (U2B.3 U2B.12), U_ANALOG CHANNEL3 (U2C.3 U2C.12), U_ANALOG CHANNEL4 (U2D.3 U2D.12)
VCC: USB-UART (FTDI FT230XS) (OPTO1.4), Microprocessor PIC18F46K80 (7 pins)
VCC_USB: Multi2Meter (P2.1), ISOLATED PSU (C9.2 R31.1 T1.2 U4.6), USB-UART (FTDI FT230XS) (7 pins)
1V: Microprocessor PIC18F46K80 (U6.8), U_ANALOG CHANNEL1 (R17A.1)
1V: Microprocessor PIC18F46K80 (U6.9), U_ANALOG CHANNEL2 (R17B.1)
1V: Microprocessor PIC18F46K80 (U6.10), U_ANALOG CHANNEL3 (R17C.1)
1V: Microprocessor PIC18F46K80 (U6.11), U_ANALOG CHANNEL4 (R17D.1)
10V: Microprocessor PIC18F46K80 (U6.32), U_ANALOG CHANNEL1 (R16A.1)
10V: Microprocessor PIC18F46K80 (U6.35), U_ANALOG CHANNEL2 (R16B.1)
10V: Microprocessor PIC18F46K80 (U6.36), U_ANALOG CHANNEL3 (R16C.1)
10V: Microprocessor PIC18F46K80 (U6.43), U_ANALOG CHANNEL4 (R16D.1)
100mA1: Microprocessor PIC18F46K80 (U6.2), U_ANALOG CHANNEL1 (R7A.1)
100mA2: Microprocessor PIC18F46K80 (U6.3), U_ANALOG CHANNEL2 (R7B.1)
100mA3: Microprocessor PIC18F46K80 (U6.4), U_ANALOG CHANNEL3 (R7C.1)
100mA4: Microprocessor PIC18F46K80 (U6.5), U_ANALOG CHANNEL4 (R7D.1)
CBUS_0: ISOLATED PSU (R28.1), USB-UART (FTDI FT230XS) (U3.12)
FREQ1: Microprocessor PIC18F46K80 (U6.38), U_ANALOG CHANNEL1 (U2A.7)
FREQ2: Microprocessor PIC18F46K80 (U6.39), U_ANALOG CHANNEL2 (U2B.7)
FREQ3: Microprocessor PIC18F46K80 (U6.40), U_ANALOG CHANNEL3 (U2C.7)
FREQ4: Microprocessor PIC18F46K80 (U6.41), U_ANALOG CHANNEL4 (U2D.7)
I_OUT1: Microprocessor PIC18F46K80 (U6.20), U_ANALOG CHANNEL1 (U2A.1)
I_OUT2: Microprocessor PIC18F46K80 (U6.22), U_ANALOG CHANNEL2 (U2B.1)
I_OUT3: Microprocessor PIC18F46K80 (U6.25), U_ANALOG CHANNEL3 (U2C.1)
I_OUT4: Microprocessor PIC18F46K80 (U6.27), U_ANALOG CHANNEL4 (U2D.1)
PWR_ENB: ISOLATED PSU (Q1.1), USB-UART (FTDI FT230XS) (U3.14)
TTL_RX: USB-UART (FTDI FT230XS) (OPTO1.3 R20.2), Microprocessor PIC18F46K80 (U6.1)
TTL_TX: USB-UART (FTDI FT230XS) (R22.2), Microprocessor PIC18F46K80 (U6.44)
USB_D+: Multi2Meter (P2.3), USB-UART (FTDI FT230XS) (C4.2 R19.1)
USB_D-: Multi2Meter (P2.2), USB-UART (FTDI FT230XS) (C5.2 R21.1)
V_OUT1: Microprocessor PIC18F46K80 (U6.19), U_ANALOG CHANNEL1 (U2A.14)
V_OUT2: Microprocessor PIC18F46K80 (U6.21), U_ANALOG CHANNEL2 (U2B.14)
V_OUT3: Microprocessor PIC18F46K80 (U6.24), U_ANALOG CHANNEL3 (U2C.14)
V_OUT4: Microprocessor PIC18F46K80 (U6.26), U_ANALOG CHANNEL4 (U2D.14)